# Altium schematic sheet adc-ic.SchDoc: AD7194
size A4; DrawnBy: Dylan Vogel; Organization: UTAT SS; DocumentNumber: 3; Revision: 2; SheetNumber: 3; SheetTotal: 13
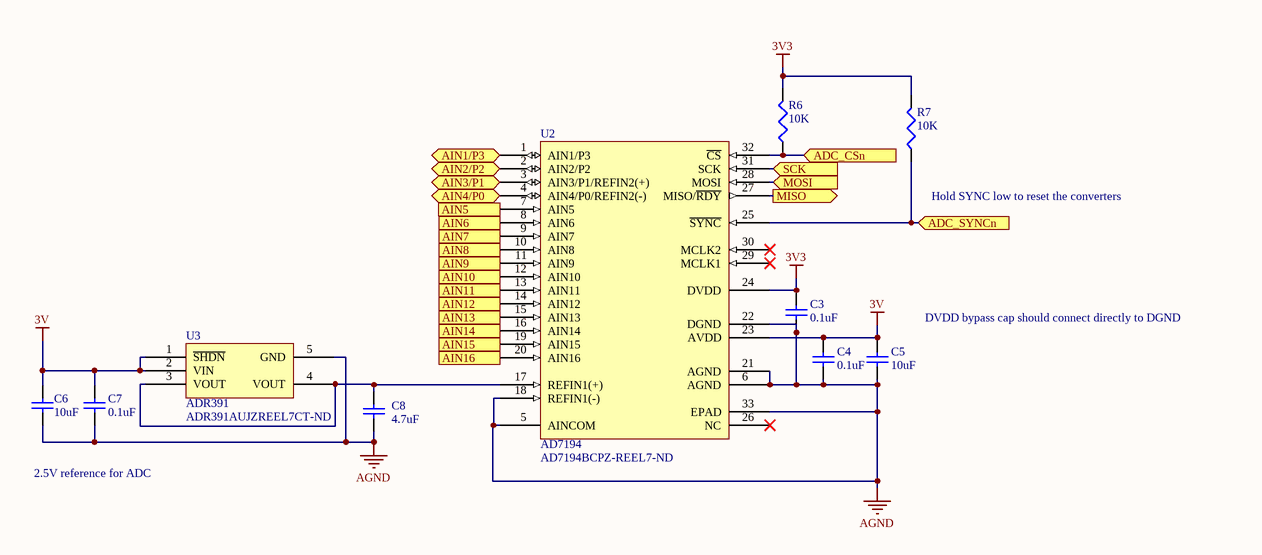
[diagram p0: adc-ic.SchDoc]

## Parts
C3  0.1uF  [0402]
C4  0.1uF  [0402]
C5  10uF  [1608[0603]]
C6  10uF  [1608[0603]]
C7  0.1uF  [0402]
C8  4.7uF  [1608[0603]]
R6  10K  [0402]
R7  10K  [0402]
U2  AD7194  Supplier Part Number 1: AD7194BCPZ-REEL7-ND
U3  ADR391  Supplier Part Number 1: ADR391AUJZREEL7CT-ND  [SOT-23-5_95P290X160-5N]

## Ports
ADC_CSn (in), ADC_SYNCn (in), AIN1/P3 (bidir), AIN2/P2 (bidir), AIN3/P1 (bidir), AIN4/P0 (bidir), AIN5 (in), AIN6 (in), AIN7 (in), AIN8 (in), AIN9 (in), AIN10 (in), AIN11 (in), AIN12 (in), AIN13 (in), AIN14 (in), AIN15 (in), AIN16 (in), MISO (out), MOSI (in), SCK (in)

## Nets
3V: C4.2 C5.2 C6.2 C7.2 U2.23(AVDD) U3.1(~{SHDN}) U3.2(VIN)
3V3: C3.2 R6.2 R7.2 U2.24(DVDD)
AGND: C3.1 C4.1 C5.1 C6.1 C7.1 C8.1 U2.5(AINCOM) U2.6(AGND) U2.18(REFIN1(-)) U2.21(AGND) U2.22(DGND) U2.33(EPAD) U3.5(GND)
ADC_CSn: R6.1 U2.32(~{CS}) ; port ADC_CSn
ADC_SYNCn: R7.1 U2.25(~{SYNC}) ; port ADC_SYNCn
AIN1/P3: U2.1(AIN1/P3) ; port AIN1/P3
AIN2/P2: U2.2(AIN2/P2) ; port AIN2/P2
AIN3/P1: U2.3(AIN3/P1/REFIN2(+)) ; port AIN3/P1
AIN4/P0: U2.4(AIN4/P0/REFIN2(-)) ; port AIN4/P0
AIN5: U2.7(AIN5) ; port AIN5
AIN6: U2.8(AIN6) ; port AIN6
AIN7: U2.9(AIN7) ; port AIN7
AIN8: U2.10(AIN8) ; port AIN8
AIN9: U2.11(AIN9) ; port AIN9
AIN10: U2.12(AIN10) ; port AIN10
AIN11: U2.13(AIN11) ; port AIN11
AIN12: U2.14(AIN12) ; port AIN12
AIN13: U2.15(AIN13) ; port AIN13
AIN14: U2.16(AIN14) ; port AIN14
AIN15: U2.19(AIN15) ; port AIN15
AIN16: U2.20(AIN16) ; port AIN16
MISO: U2.27(MISO/~{RDY}) ; port MISO
MOSI: U2.28(MOSI) ; port MOSI
SCK: U2.31(SCK) ; port SCK
NetC8_2: C8.2 U2.17(REFIN1(+)) U3.3(VOUT) U3.4(VOUT)

Not connected (* = marked no-connect by the designer): U2 26(NC)* 29(MCLK1)* 30(MCLK2)*

## Notes on the sheet
- (near R7) Hold SYNC low to reset the converters
- DVDD bypass cap should connect directly to DGND
- 2.5V reference for ADC

## Library data of the parts
C3-C8 = Cap Semi: Capacitor (Semiconductor SIM Model); Published: 8-Jun-2000; LatestRevisionDate: 29-May-2009; LatestRevisionNote: IPC-7351 Footprint Added.; PackageReference: C1206; Publisher: Altium Limited; PackageDescription: Chip Capacitor; Supplier: Digi-Key; Supplier 1: Digi-Key
  C3 C4 C7: Value: 0.1uF
  C5 C6: Value: 10uF
  C8: Value: 4.7uF
R6 R7 = Res3: Resistor; Published: 8-Jun-2000; LatestRevisionDate: 29-May-2009; LatestRevisionNote: IPC-7351 Footprint Added.; PackageReference: J1-0603; Publisher: Altium Limited; PackageDescription: Chip Resistor; Value: 10K; Supplier: Digi-Key; Supplier 1: Digi-Key
U2 = AD7194: 24-bit sigma-delta ADC; Supplier 1: Digi-Key
U3 = ADR391: 2.5V reference voltage.; Supplier 1: Digi-Key; Supplier: Digi-Key